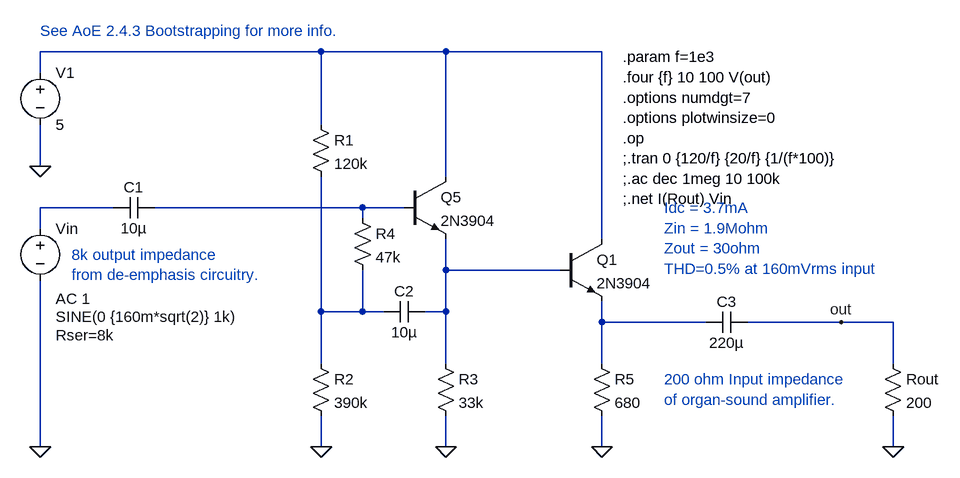
[diagram p0: schematic amp2.asc]
amp2.asc, the LTspice schematic file:
Version 4
SHEET 1 1484 760
WIRE 32 0 -400 0
WIRE 224 0 32 0
WIRE 464 0 224 0
WIRE -400 32 -400 0
WIRE 32 112 32 0
WIRE -400 176 -400 112
WIRE 224 192 224 0
WIRE -288 240 -400 240
WIRE 96 240 -224 240
WIRE 160 240 96 240
WIRE 96 256 96 240
WIRE -400 272 -400 240
WIRE 464 288 464 0
WIRE 224 336 224 288
WIRE 400 336 224 336
WIRE 32 400 32 192
WIRE 96 400 96 336
WIRE 96 400 32 400
WIRE 128 400 96 400
WIRE 224 400 224 336
WIRE 224 400 192 400
WIRE 464 416 464 384
WIRE 624 416 464 416
WIRE 832 416 688 416
WIRE 912 416 832 416
WIRE 32 480 32 400
WIRE 224 480 224 400
WIRE 464 480 464 416
WIRE 912 480 912 416
WIRE -400 608 -400 352
WIRE 32 608 32 560
WIRE 224 608 224 560
WIRE 464 608 464 560
WIRE 912 608 912 560
FLAG -400 176 0
FLAG -400 608 0
FLAG 912 608 0
FLAG 832 416 out
FLAG 224 608 0
FLAG 32 608 0
FLAG 464 608 0
DATAFLAG 320 336 ""
DATAFLAG 560 416 ""
DATAFLAG -80 240 ""
DATAFLAG 32 352 ""
SYMBOL voltage -400 16 R0
SYMATTR InstName V1
SYMATTR Value 5
SYMBOL cap -224 224 R90
WINDOW 0 0 32 VBottom 2
WINDOW 3 32 32 VTop 2
SYMATTR InstName C1
SYMATTR Value 10µ
SYMBOL voltage -400 256 R0
WINDOW 3 24 152 Left 2
WINDOW 123 24 124 Left 2
WINDOW 39 24 180 Left 2
SYMATTR Value SINE(0 {160m*sqrt(2)} 1k)
SYMATTR Value2 AC 1
SYMATTR SpiceLine Rser=8k
SYMATTR InstName Vin
SYMBOL npn 160 192 R0
SYMATTR InstName Q5
SYMATTR Value 2N3904
SYMBOL cap 688 400 R90
WINDOW 0 0 32 VBottom 2
WINDOW 3 32 32 VTop 2
SYMATTR InstName C3
SYMATTR Value 220µ
SYMBOL res 896 464 R0
SYMATTR InstName Rout
SYMATTR Value 200
SYMBOL res 16 96 R0
SYMATTR InstName R1
SYMATTR Value 120k
SYMBOL res 16 464 R0
SYMATTR InstName R2
SYMATTR Value 390k
SYMBOL res 208 464 R0
SYMATTR InstName R3
SYMATTR Value 33k
SYMBOL res 80 240 R0
SYMATTR InstName R4
SYMATTR Value 47k
SYMBOL cap 192 384 R90
WINDOW 0 0 32 VBottom 2
WINDOW 3 32 32 VTop 2
SYMATTR InstName C2
SYMATTR Value 10µ
SYMBOL npn 400 288 R0
SYMATTR InstName Q1
SYMATTR Value 2N3904
SYMBOL res 448 464 R0
SYMATTR InstName R5
SYMATTR Value 680
TEXT 496 8 Left 2 !.param f=1e3\n.four {f} 10 100 V(out)\n.options numdgt=7\n.options plotwinsize=0\n.op\n;.tran 0 {120/f} {20/f} {1/(f*100)}\n;.ac dec 1meg 10 100k\n;.net I(Rout) Vin
TEXT -352 312 Left 2 ;8k output impedance \nfrom de-emphasis circuitry.
TEXT 560 504 Left 2 ;200 ohm Input impedance\nof organ-sound amplifier.
TEXT -400 -32 Left 2 ;See AoE 2.4.3 Bootstrapping for more info.
TEXT 560 240 Left 2 ;Idc = 3.7mA\nZin = 1.9Mohm\nZout = 30ohm\nTHD=0.5% at 160mVrms input

The netlist it stands for:
* amp2.asc
V1 N001 0 5
C1 N003 N002 10µ
Vin N002 0 SINE(0 {160m*sqrt(2)} 1k) AC 1 Rser=8k
Q5 N001 N003 N004 0 2N3904
C3 out N006 220µ
Rout out 0 200
R1 N001 N005 120k
R2 N005 0 390k
R3 N004 0 33k
R4 N003 N005 47k
C2 N004 N005 10µ
Q1 N001 N004 N006 0 2N3904
R5 N006 0 680
.model NPN NPN
.model PNP PNP
.lib standard.bjt
.param f=1e3
.four {f} 10 100 V(out)
.options numdgt=7
.options plotwinsize=0
.op
;.tran 0 {120/f} {20/f} {1/(f*100)}
;.ac dec 1meg 10 100k
;.net I(Rout) Vin
* 8k output impedance
* from de-emphasis circuitry.
* 200 ohm Input impedance
* of organ-sound amplifier.
* See AoE 2.4.3 Bootstrapping for more info.
* Idc = 3.7mA
* Zin = 1.9Mohm
* Zout = 30ohm
* THD=0.5% at 160mVrms input
.backanno
.end